# EAGLE design Launch_Tower_Power_Interface_Board_v1-2 (EAGLE 6.2)
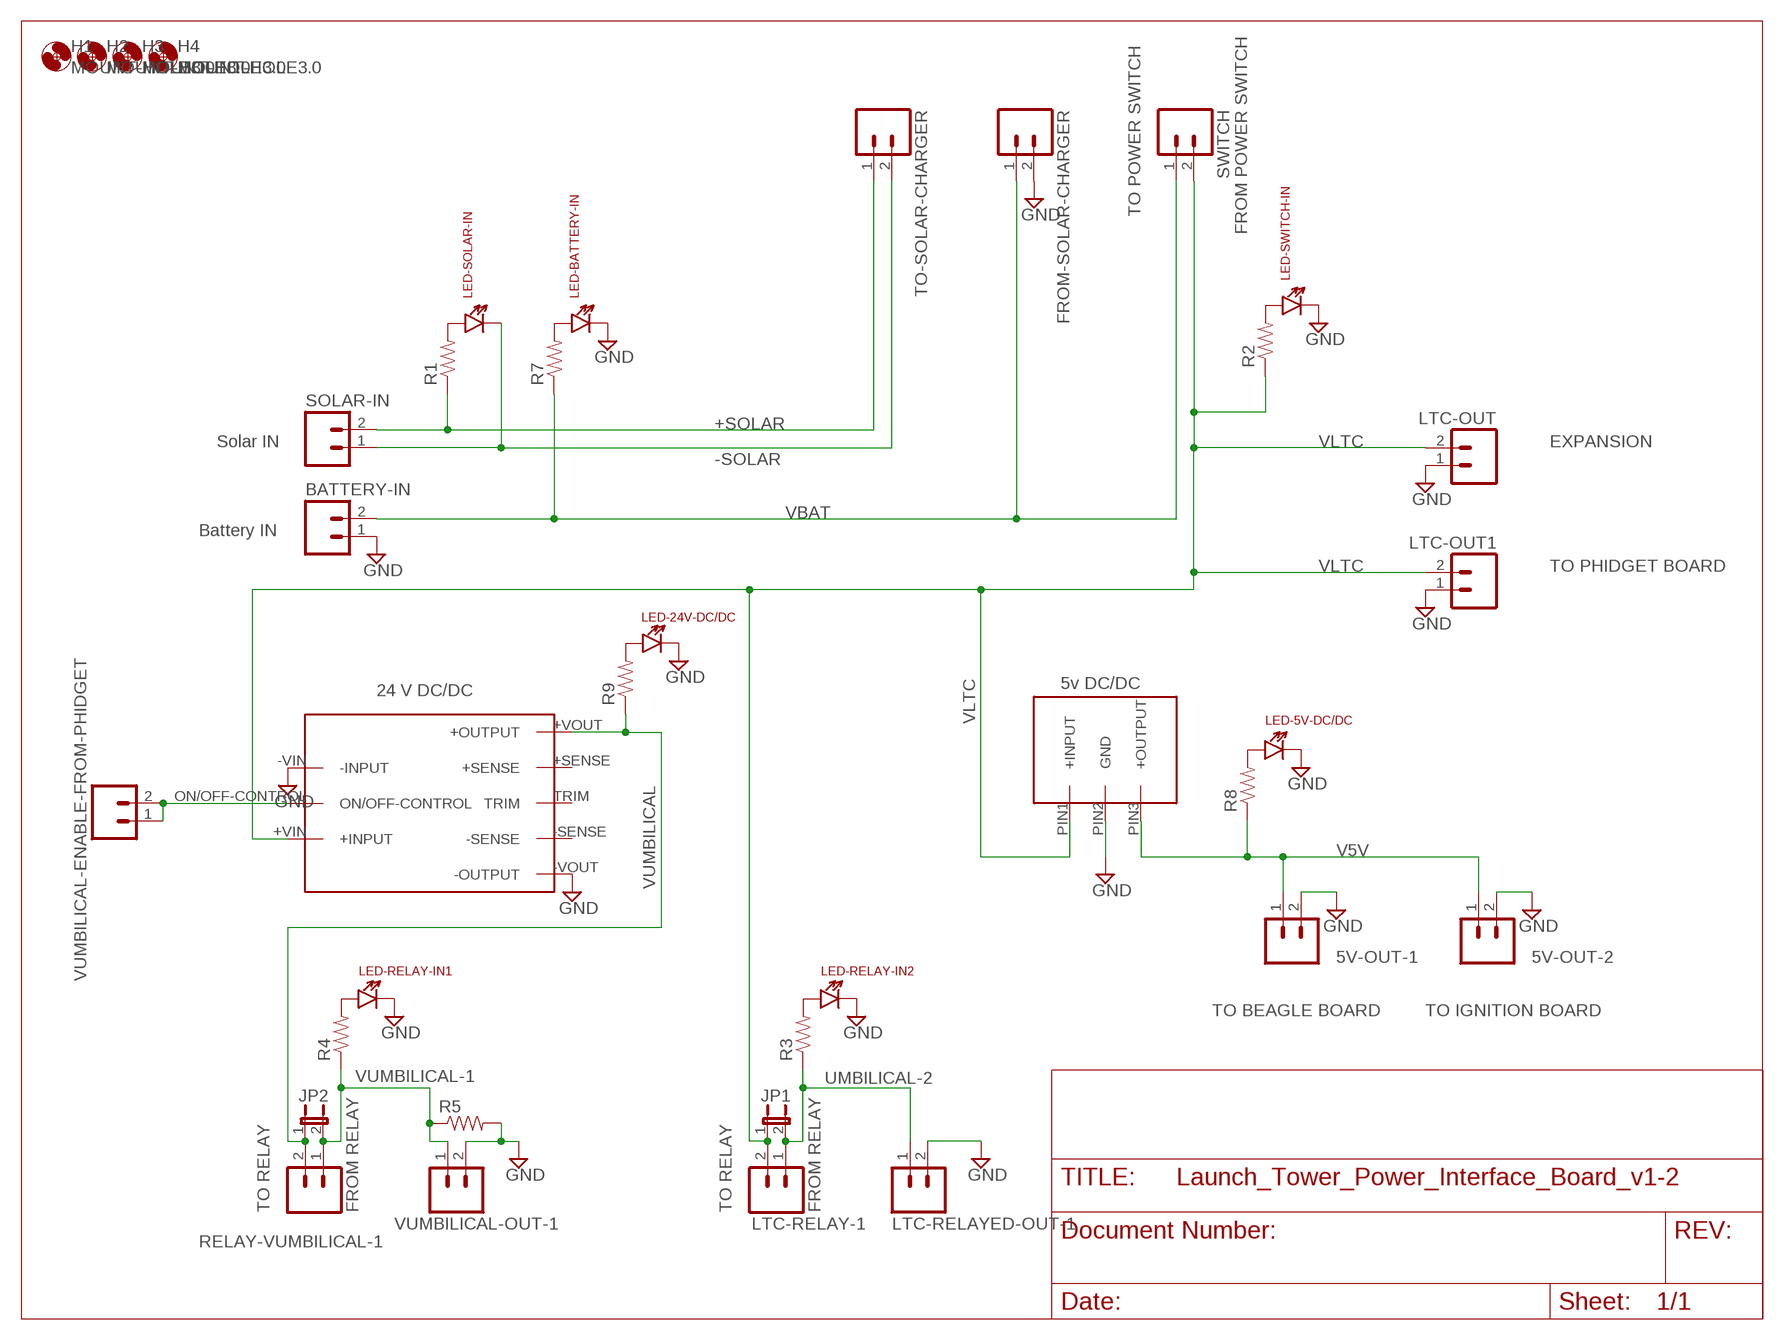
[diagram p0: schematic, sheet 1]

## Parts
5V-OUT-1  M025MM  [SCREWTERMINAL-5MM-2]
5V-OUT-2  M025MM  [SCREWTERMINAL-5MM-2]
BATTERY-IN  M025MM  [SCREWTERMINAL-5MM-2]
FROM-SOLAR-CHARGER  M025MM  [SCREWTERMINAL-5MM-2]
H1  MOUNT-HOLE3.0  [3,0]
H2  MOUNT-HOLE3.0  [3,0]
H3  MOUNT-HOLE3.0  [3,0]
H4  MOUNT-HOLE3.0  [3,0]
JP1  JUMPER-2PTH  [1X02]
JP2  JUMPER-2PTH  [1X02]
LED-5V-DC/DC  LTE-302  [LTE-302]
LED-24V-DC/DC  LTE-302  [LTE-302]
LED-BATTERY-IN  LTE-302  [LTE-302]
LED-RELAY-IN1  LTE-302  [LTE-302]
LED-RELAY-IN2  LTE-302  [LTE-302]
LED-SOLAR-IN  LTE-302  [LTE-302]
LED-SWITCH-IN  LTE-302  [LTE-302]
LTC-OUT  M025MM  [SCREWTERMINAL-5MM-2]
LTC-OUT1  M025MM  [SCREWTERMINAL-5MM-2]
LTC-RELAY-1  M025MM  [SCREWTERMINAL-5MM-2]
LTC-RELAYED-OUT-1  M025MM  [SCREWTERMINAL-5MM-2]
R1  RESISTORPTH-1/2W  [AXIAL-0.5]
R2  RESISTORPTH-1/2W  [AXIAL-0.5]
R3  RESISTORPTH-1/2W  [AXIAL-0.5]
R4  RESISTORPTH-1/2W  [AXIAL-0.5]
R5  RESISTORPTH-1/2W  [AXIAL-0.5]
R7  RESISTORPTH-1/2W  [AXIAL-0.5]
R8  RESISTORPTH-1/2W  [AXIAL-0.5]
R9  RESISTORPTH-1/2W  [AXIAL-0.5]
RELAY-VUMBILICAL-1  M025MM  [SCREWTERMINAL-5MM-2]
SOLAR-IN  M025MM  [SCREWTERMINAL-5MM-2]
SWITCH  M025MM  [SCREWTERMINAL-5MM-2]
TO-SOLAR-CHARGER  M025MM  [SCREWTERMINAL-5MM-2]
U$1  DC/DC_CONV_24V  [UWE]
U$2  DC/DC_CONV_5V  [OKI-SIP]
VUMBILICAL-ENABLE-FROM-PHIDGET  M023.5MM  [SCREWTERMINAL-3.5MM-2]
VUMBILICAL-OUT-1  M025MM  [SCREWTERMINAL-5MM-2]

## Nets
+SOLAR: R1.P$1 SOLAR-IN.2 TO-SOLAR-CHARGER.1
-SOLAR: LED-SOLAR-IN.C SOLAR-IN.1 TO-SOLAR-CHARGER.2
GND: 5V-OUT-1.2 5V-OUT-2.2 BATTERY-IN.1 FROM-SOLAR-CHARGER.2 LED-5V-DC/DC.C LED-24V-DC/DC.C LED-BATTERY-IN.C LED-RELAY-IN1.C LED-RELAY-IN2.C LED-SWITCH-IN.C LTC-OUT1.1 LTC-OUT.1 LTC-RELAYED-OUT-1.2 R5.P$2 U$1.-VIN(-INPUT) U$1.-VOUT(-OUTPUT) U$2.PIN2(GND) VUMBILICAL-OUT-1.2
GPIO: U$1.ON/OFF-CONTROL VUMBILICAL-ENABLE-FROM-PHIDGET.1 VUMBILICAL-ENABLE-FROM-PHIDGET.2
N$1: LED-SOLAR-IN.A R1.P$2
N$5: LED-SWITCH-IN.A R2.P$2
N$6: LED-RELAY-IN2.A R3.P$2
N$8: LED-BATTERY-IN.A R7.P$2
N$9: LED-5V-DC/DC.A R8.P$2
N$10: LED-RELAY-IN1.A R4.P$2
N$11: LED-24V-DC/DC.A R9.P$2
UMBILICAL-2: JP1.2 LTC-RELAY-1.1 LTC-RELAYED-OUT-1.1 R3.P$1
V5V: 5V-OUT-1.1 5V-OUT-2.1 R8.P$1 U$2.PIN3(+OUTPUT)
VBAT: BATTERY-IN.2 FROM-SOLAR-CHARGER.1 R7.P$1 SWITCH.1
VLTC: JP1.1 LTC-OUT1.2 LTC-OUT.2 LTC-RELAY-1.2 R2.P$1 SWITCH.2 U$1.+VIN(+INPUT) U$2.PIN1(+INPUT)
VUMBILICAL: JP2.1 R9.P$1 RELAY-VUMBILICAL-1.2 U$1.+VOUT(+OUTPUT)
VUMBILICAL-1: JP2.2 R4.P$1 R5.P$1 RELAY-VUMBILICAL-1.1 VUMBILICAL-OUT-1.1
Unconnected: U$1.+SENSE U$1.-SENSE U$1.TRIM

## Notes on the sheet
- TO POWER SWITCH
- FROM POWER SWITCH
- Solar IN | EXPANSION
- Battery IN
- TO PHIDGET BOARD
- 5v DC/DC
- 24 V DC/DC
- TO BEAGLE BOARD | TO IGNITION BOARD
- TO RELAY | FROM RELAY | TO RELAY | FROM RELAY

## Library data of the parts
5V-OUT-1 5V-OUT-2 BATTERY-IN FROM-SOLAR-CHARGER LTC-OUT LTC-OUT1 LTC-RELAY-1 LTC-RELAYED-OUT-1 RELAY-VUMBILICAL-1 SOLAR-IN SWITCH TO-SOLAR-CHARGER VUMBILICAL-OUT-1 = SparkFun:M02: Header 2 Standard 2-pin 0.1" header. Use with straight break away headers (SKU : PRT-00116), right angle break away headers (PRT-00553), swiss pins (PRT-00743), machine pins (PRT-00117), and female headers (PRT-00115). Molex polarized connector foot print use with SKU : PRT-08233 with associated crimp pins and housings.
H1-H4 = holes:MOUNT-HOLE: MOUNTING HOLE with drill center marker
JP1 JP2 = SparkFun:JUMPER-2: Jumper Basic 0.1" spaced jumper. Use with breakaway headers.
LED-5V-DC/DC LED-24V-DC/DC LED-BATTERY-IN LED-RELAY-IN1 LED-RELAY-IN2 LED-SOLAR-IN LED-SWITCH-IN = SparkFun-LED:LTE-302: Through-hole side-firing 940nm IR LED
R1-R5 R7-R9 = SparkFun-Passives:RESISTOR: Resistor Basic schematic elements and footprints for 0603, 1206, and PTH resistors.
U$1 = launch-tower:DC/DC_CONV_24V
U$2 = launch-tower:DC/DC_CONV_5V
VUMBILICAL-ENABLE-FROM-PHIDGET = SparkFun-Connectors:M02: Header 2 Standard 2-pin 0.1" header. Use with straight break away headers (SKU : PRT-00116), right angle break away headers (PRT-00553), swiss pins (PRT-00743), machine pins (PRT-00117), and female headers (PRT-00115). Molex polarized connector foot print use with SKU : PRT-08233 with associated crimp pins and housings.

## Board
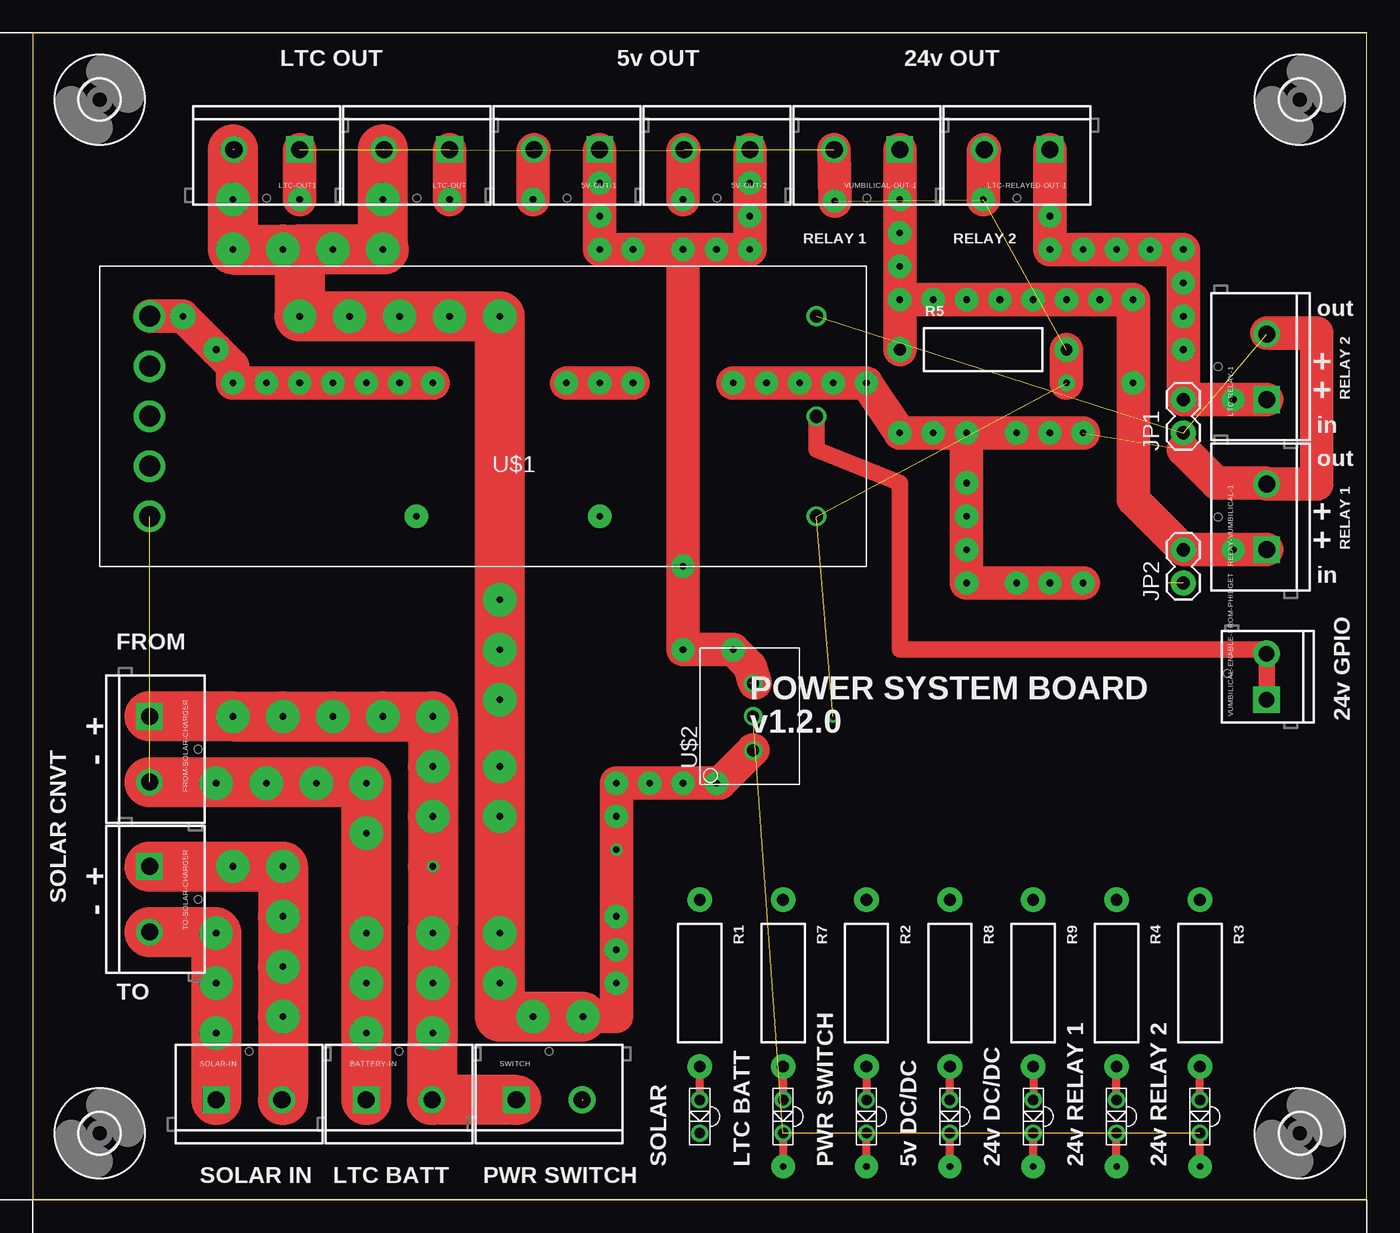
[diagram p1: board, top side]
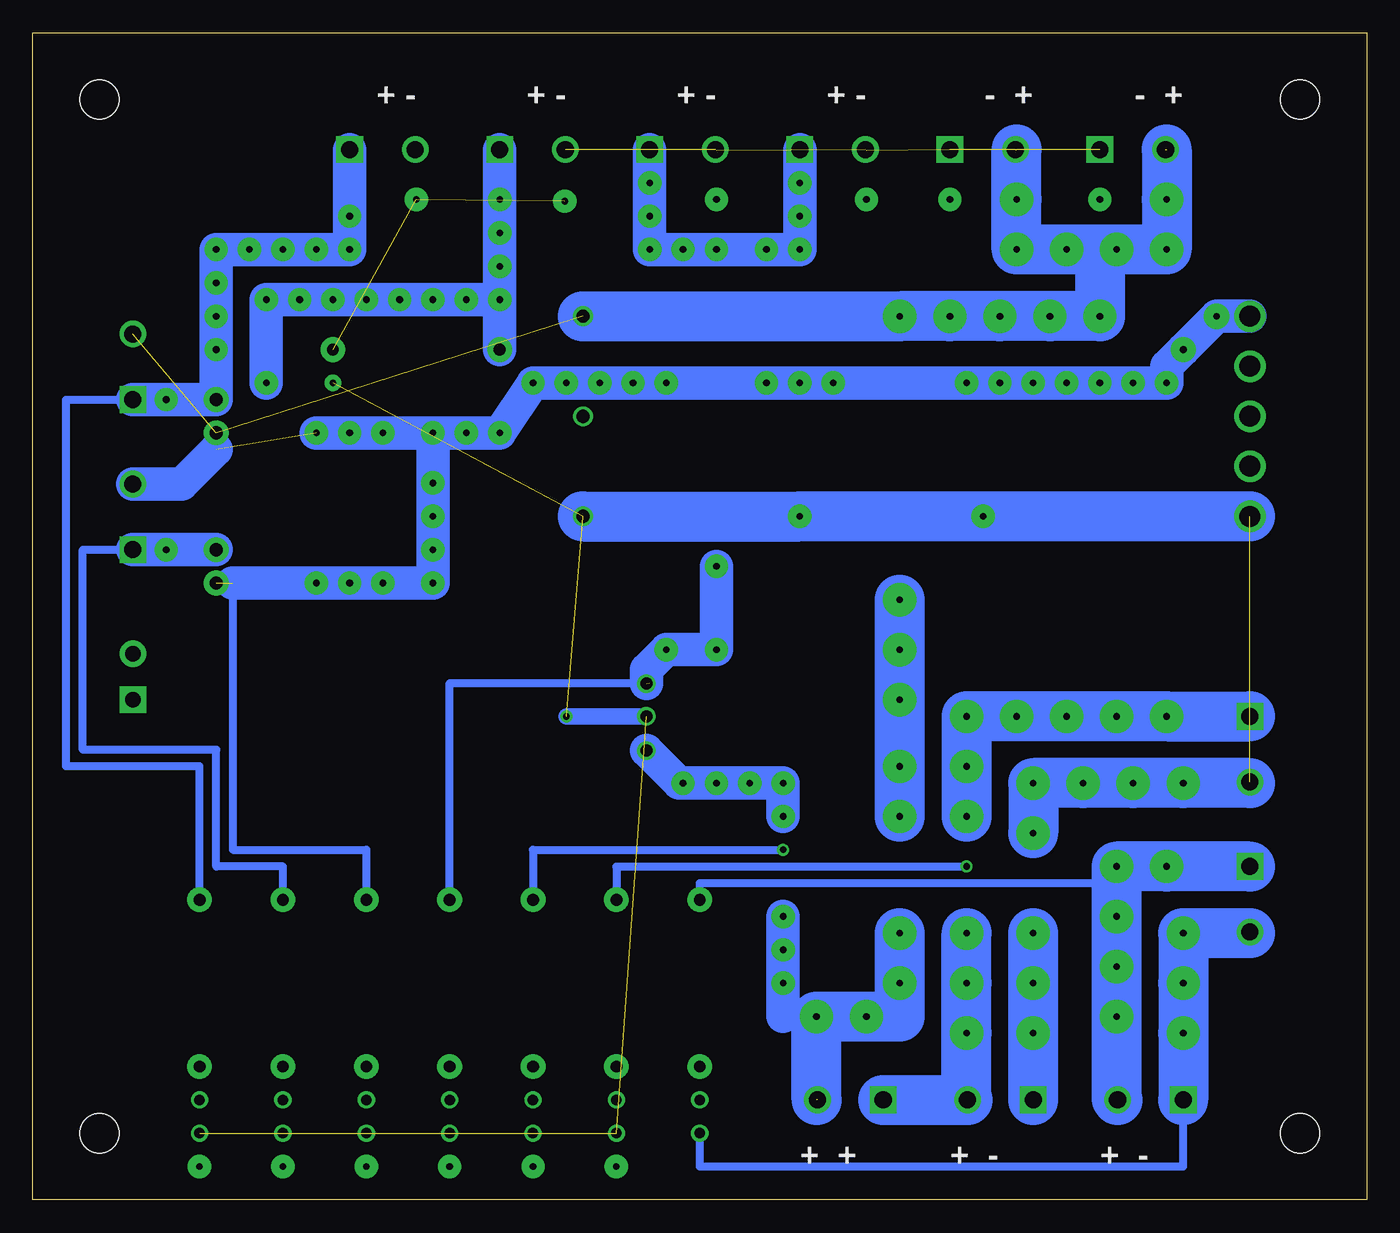
[diagram p2: board, bottom side, seen from below]

Size 101.6 x 88.9 mm. Coordinates in mm from the lower left corner, seen from the top.
Outline: 0,0 101.6,0 101.6,88.9 0,88.9 0,0
Copper layers (1*16): Top 0.035mm / dielectric 1.5mm / Bottom 0.035mm
Design rules: minimum track width 10mil, minimum drill 24mil, track to track 8mil, track to pad 8mil, pad to pad 8mil, via to via 8mil, smd to smd 8mil, copper to edge 40mil, drill to drill 8mil, minimum pad ring 10mil, minimum via ring 8mil, stop-mask expansion 4mil, vias tented up to drill 0mil, thermal gap 10mil

### Footprints (pad centres in the part's own frame; a part is rotated, then mirrored left to right if it is on the bottom)
SCREWTERMINAL-5MM-2 = drill 1.3 pad 2.032 square: 1 0,0 | drill 1.3 pad 2.032: 2 5,0
3,0 = hole 3: 0,0
1X02 = drill 1.016 pad 1.88: 1 0,0; 2 2.54,0
LTE-302 = drill 0.8: A 1.27,0; C -1.27,0
AXIAL-0.5 = drill 0.9 pad 1.88: P$1 -6.35,0; P$2 6.35,0
UWE = drill 1.6: +SENSE 25.4,-3.81; +VOUT 25.4,-7.62; -SENSE 25.4,3.81; -VOUT 25.4,7.62; TRIM 25.4,0 | drill 1: +VIN -25.4,-7.62; -VIN -25.4,7.62; ON/OFF-CONTROL -25.4,0
OKI-SIP = drill 0.9 pad 0.813: PIN1 -2.6,-0.25; PIN2 0,-0.25; PIN3 2.5,-0.25
SCREWTERMINAL-3.5MM-2 = drill 1.2 pad 2.032 square: 1 0,0 | drill 1.2 pad 2.032: 2 3.5,0

### Placement (x,y rotation side)
5V-OUT-1  43.18,80.01 180 top
5V-OUT-2  54.61,80.01 180 top
BATTERY-IN  25.4,7.62 0 top
FROM-SOLAR-CHARGER  8.89,36.83 270 top
H1  5.08,83.82 0 top
H2  5.08,5.08 0 top
H3  96.52,5.08 0 top
H4  96.52,83.82 0 top
JP1  87.63,58.42 90 top
JP2  87.63,46.99 90 top
LED-5V-DC/DC  69.85,6.35 90 top
LED-24V-DC/DC  76.2,6.35 90 top
LED-BATTERY-IN  57.15,6.35 90 top
LED-RELAY-IN1  82.55,6.35 90 top
LED-RELAY-IN2  88.9,6.35 90 top
LED-SOLAR-IN  50.8,6.35 90 top
LED-SWITCH-IN  63.5,6.35 90 top
LTC-OUT  31.75,80.01 180 top
LTC-OUT1  20.32,80.01 180 top
LTC-RELAY-1  93.98,60.96 90 top
LTC-RELAYED-OUT-1  77.47,80.01 180 top
R1  50.8,16.51 270 top
R2  63.5,16.51 270 top
R3  88.9,16.51 270 top
R4  82.55,16.51 270 top
R5  72.39,64.77 0 top
R7  57.15,16.51 270 top
R8  69.85,16.51 270 top
R9  76.2,16.51 270 top
RELAY-VUMBILICAL-1  93.98,49.53 90 top
SOLAR-IN  13.97,7.62 0 top
SWITCH  36.83,7.62 0 top
TO-SOLAR-CHARGER  8.89,25.4 270 top
U$1  34.29,59.69 180 top
U$2  54.61,36.83 90 top
VUMBILICAL-ENABLE-FROM-PHIDGET  93.98,38.1 90 top
VUMBILICAL-OUT-1  66.04,80.01 180 top

### Tracks (layer width: path | path; a pad name or v marks a point on that pad's centre or on a via)
+SOLAR  (via drill 0.51 pad 2.54)
  Top 3.81: TO-SOLAR-CHARGER.1 v15.24,25.4 v19.05,25.4 v19.05,21.59 v19.05,17.78 v19.05,13.97 19.05,7.62
  Bottom 0.61: R1.P$1 50.8,24.13 19.05,24.13
  Bottom 3.81: TO-SOLAR-CHARGER.1 v15.24,25.4 v19.05,25.4 19.05,24.13 v19.05,21.59 v19.05,17.78 v19.05,13.97 19.05,7.7 SOLAR-IN.2
-SOLAR  (via drill 0.51 pad 2.54)
  Top 3.81: TO-SOLAR-CHARGER.2 13.89,20.4 v13.97,20.32 v13.97,16.51 v13.97,12.7 SOLAR-IN.1
  Bottom 0.61: LED-SOLAR-IN.C 50.8,2.54 13.97,2.54 SOLAR-IN.1
  Bottom 3.81: 8.89,20.32 v13.97,20.32 v13.97,16.51 v13.97,12.7 SOLAR-IN.1
GND  (via drill 0.51, 0.51 pad 1.27, 0.51 pad 1.78, 0.51 pad 2.54)  (15 unrouted)
  Top 0.61: LED-BATTERY-IN.C v57.15,2.54 | v63.5,2.54 LED-SWITCH-IN.C | v69.85,2.54 LED-5V-DC/DC.C | v76.2,2.54 LED-24V-DC/DC.C | v88.9,2.54 LED-RELAY-IN2.C | v82.55,2.54 LED-RELAY-IN1.C
  Top 2.54: LTC-OUT1.1 v20.32,76.2 | LTC-OUT.1 v31.75,76.2 | v38.1,76.2 38.1,79.93 5V-OUT-1.2 | v49.53,76.2 49.53,79.93 5V-OUT-2.2 | VUMBILICAL-OUT-1.2 v61.09,76.07 | v72.39,76.2 72.39,79.93 LTC-RELAYED-OUT-1.2 | R5.P$2 v78.74,62.23
  Top 3.81: FROM-SOLAR-CHARGER.2 25.4,31.83 v25.4,31.75 v25.4,27.94 v25.4,20.32 v25.4,16.51 v25.4,12.7 BATTERY-IN.1
  Bottom 1.27: U$2.PIN2 v60.96,36.83
  Bottom 3.81: U$1.-VOUT v29.21,52.07 v43.18,52.07 U$1.-VIN | BATTERY-IN.1 v25.4,12.7 v25.4,16.51 v25.4,20.32 | 8.89,31.75 v13.97,31.75 v17.78,31.75 v21.59,31.75 v25.4,31.75 v25.4,27.94
GPIO
  Top 1.27: U$1.ON/OFF-CONTROL 59.69,57.15 66.04,54.61 66.04,41.91 93.67,41.91 VUMBILICAL-ENABLE-FROM-PHIDGET.2 VUMBILICAL-ENABLE-FROM-PHIDGET.1
N$1
  Top 0.61: LED-SOLAR-IN.A R1.P$2
N$2  (via drill 0.51 pad 2.54)
  Bottom 3.81: 30.48,7.62 v30.48,12.7 v30.48,16.51 v30.48,20.32
N$5
  Top 0.61: R2.P$2 LED-SWITCH-IN.A
N$6
  Top 0.61: LED-RELAY-IN2.A R3.P$2
N$8
  Top 0.61: R7.P$2 LED-BATTERY-IN.A
N$9
  Top 0.61: LED-5V-DC/DC.A R8.P$2
N$10
  Top 0.61: LED-RELAY-IN1.A R4.P$2
N$11
  Top 0.61: R9.P$2 LED-24V-DC/DC.A
UMBILICAL-2  (via drill 0.51 pad 1.78)
  Top 2.54: LTC-RELAY-1.1 v91.44,60.96 JP1.2 v87.63,64.77 v87.63,67.31 v87.63,69.85 v87.63,72.39 v85.09,72.39 v82.55,72.39 v80.01,72.39 v77.47,72.39 v77.47,74.93 LTC-RELAYED-OUT-1.1
  Bottom 0.61: R3.P$1 88.9,33.02 99.06,33.02 99.06,60.96 LTC-RELAY-1.1
  Bottom 2.54: LTC-RELAY-1.1 v91.44,60.96 JP1.2 v87.63,64.77 v87.63,67.31 v87.63,69.85 v87.63,72.39 v85.09,72.39 v82.55,72.39 v80.01,72.39 v77.47,72.39 v77.47,74.93 LTC-RELAYED-OUT-1.1
V5V  (via drill 0.51 pad 1.78)  (1 unrouted)
  Top 2.54: 54.99,39.37 54.61,40.64 v53.34,41.91 v49.53,41.91 v49.53,48.26 v49.53,72.39 | v49.53,72.39 v52.07,72.39 v54.61,72.39 v54.61,74.93 v54.61,77.47 5V-OUT-2.1 | v49.53,72.39 v45.72,72.39 v43.18,72.39 v43.18,74.93 v43.18,77.47 5V-OUT-1.1
  Bottom 0.61: R8.P$1 69.85,39.37 54.61,39.37
  Bottom 2.54: U$2.PIN3 54.86,40.39 v53.34,41.91 v49.53,41.91 v49.53,48.26 | 5V-OUT-2.1 v54.61,77.47 v54.61,74.93 v54.61,72.39 v52.07,72.39 v49.53,72.39 v45.72,72.39 v43.18,72.39 v43.18,74.93 v43.18,77.47 5V-OUT-1.1
VBAT  (via drill 0.51, 0.51 pad 2.54)
  Top 3.81: BATTERY-IN.2 v30.48,25.4 v30.48,29.21 v30.48,33.02 v30.48,36.83 v26.67,36.83 v22.86,36.83 v19.05,36.83 v15.24,36.83 FROM-SOLAR-CHARGER.1 | SWITCH.1 30.48,7.62
  Bottom 0.61: v30.48,25.4 57.15,25.4 R7.P$1
  Bottom 3.81: v30.48,29.21 v30.48,33.02 v30.48,36.83 v26.67,36.83 v22.86,36.83 v19.05,36.83 v15.24,36.83 FROM-SOLAR-CHARGER.1 | SWITCH.1 BATTERY-IN.2
VLTC  (via drill 0.51 pad 0.61, 0.51 pad 1.78, 0.51 pad 2.54)  (5 unrouted)
  Top 2.54: 41.83,13.97 v41.91,13.97 44.45,13.97 v44.45,16.51 v44.45,19.05 v44.45,21.59 v44.45,26.67 v44.45,29.21 v44.45,31.75 v46.99,31.75 v49.53,31.75 v52.07,31.75 52.32,31.75 54.86,34.29
  Top 3.81: 15.24,80.01 v15.24,76.2 v15.24,72.39 v19.05,72.39 20.32,72.39 | 26.75,72.39 v26.67,72.39 | v26.67,72.39 v22.86,72.39 20.32,72.39 | 20.32,72.39 v20.32,67.31 v24.13,67.31 v27.94,67.31 v31.75,67.31 v35.56,67.31 v35.56,45.72 v35.56,41.91 v35.56,38.1 v35.56,33.02 v35.56,29.21 v35.56,20.32 v35.56,16.51 35.56,13.97 v38.1,13.97 41.83,13.97 | v26.67,72.39 26.67,80.01
  Bottom 0.61: v44.45,26.67 63.5,26.67 R2.P$1
  Bottom 2.54: v44.45,29.21 v44.45,31.75 v46.99,31.75 v49.53,31.75 v52.07,31.75 52.38,31.75 U$2.PIN1 | v44.45,21.59 v44.45,19.05 v44.45,16.51 44.45,13.97
  Bottom 3.81: U$1.+VIN v35.56,67.31 v31.75,67.31 v27.94,67.31 v24.13,67.31 v20.32,67.31 20.32,72.39 | 15.24,80.01 v15.24,76.2 v15.24,72.39 v19.05,72.39 20.32,72.39 | 20.32,72.39 v22.86,72.39 v26.67,72.39 v26.67,76.2 26.67,80.01 | 41.91,7.62 v41.91,13.97 v38.1,13.97 35.56,13.97 v35.56,16.51 v35.56,20.32 | v35.56,29.21 v35.56,33.02 v35.56,38.1 v35.56,41.91 v35.56,45.72
VUMBILICAL  (via drill 0.51 pad 1.78, 0.51 pad 1.93)  (2 unrouted)
  Top 2.54: 93.98,66.04 97.79,66.04 97.79,54.53 RELAY-VUMBILICAL-1.2 93.9,54.61 90.17,54.61 87.63,57.15 | v30.48,62.23 v27.94,62.23 v25.4,62.23 v22.86,62.23 v20.32,62.23 v17.78,62.23 v15.24,62.23 15.24,63.5 v13.97,64.77 v11.43,67.31 U$1.+VOUT | v40.64,62.23 v43.18,62.23 v45.72,62.23 | v53.34,62.23 v55.88,62.23 v58.42,62.23 v60.96,62.23 v63.5,62.23 v66.04,58.42 v68.58,58.42 v71.12,58.42 | v71.12,58.42 v74.93,58.42 v77.47,58.42 v80.01,58.42 | v71.12,58.42 v71.12,54.61 v71.12,52.07 v71.12,49.53 v71.12,46.99 v74.93,46.99 v77.47,46.99 v80.01,46.99
  Bottom 0.61: 86.36,46.99 86.36,26.67 76.2,26.67 R9.P$1
  Bottom 2.54: RELAY-VUMBILICAL-1.2 90.25,54.53 87.63,57.15 | v71.12,58.42 v68.58,58.42 v66.04,58.42 v63.5,62.23 v60.96,62.23 v58.42,62.23 v55.88,62.23 v53.34,62.23 v45.72,62.23 v43.18,62.23 v40.64,62.23 v30.48,62.23 v27.94,62.23 v25.4,62.23 v22.86,62.23 v20.32,62.23 v17.78,62.23 v15.24,62.23 15.24,63.5 v13.97,64.77 v11.43,67.31 U$1.+VOUT | v71.12,58.42 v71.12,54.61 | v71.12,54.61 71.12,58.34 | v71.12,54.61 v71.12,52.07 v71.12,49.53 v71.12,46.99 v74.93,46.99 v77.47,46.99 v80.01,46.99 86.36,46.99 | v80.01,58.42 v77.47,58.42 v74.93,58.42 v71.12,58.42
VUMBILICAL-1  (via drill 0.51 pad 1.78)
  Top 2.54: v66.04,68.58 v68.58,68.58 v71.12,68.58 v73.66,68.58 v76.2,68.58 v78.74,68.58 v81.28,68.58 v83.82,68.58 v83.82,62.23 83.82,53.34 JP2.2 v91.44,49.53 RELAY-VUMBILICAL-1.1 | v66.04,68.58 v66.04,71.12 v66.04,73.66 v66.04,76.2 VUMBILICAL-OUT-1.1 | R5.P$1 v66.04,68.58
  Bottom 0.61: R4.P$1 82.55,25.4 87.63,25.4 87.63,34.29 97.79,34.29 97.79,49.53 RELAY-VUMBILICAL-1.1
  Bottom 2.54: VUMBILICAL-OUT-1.1 v66.04,76.2 v66.04,73.66 v66.04,71.12 v66.04,68.58 | v66.04,68.58 v68.58,68.58 v71.12,68.58 v73.66,68.58 v76.2,68.58 v78.74,68.58 v81.28,68.58 v83.82,68.58 v83.82,62.23 | R5.P$1 v66.04,68.58 | RELAY-VUMBILICAL-1.1 v91.44,49.53 JP2.2

### Text on the board
tPlace: LTC OUT | 5v OUT | 24v OUT | RELAY 1 | RELAY 2 | out | + + | RELAY 2 | in | out | + + | RELAY 1 | in | 24v GPIO | FROM | - + | SOLAR CNVT | - + | TO | SOLAR | LTC BATT | PWR SWITCH | 5v DC/DC | 24v DC/DC | 24v RELAY 1 | 24v RELAY 2 | SOLAR IN | LTC BATT | PWR SWITCH
bPlace: - + | - + | + - | + - | + - | + - | + - | + - | + +
tNames: POWER SYSTEM BOARD | v1.2.0